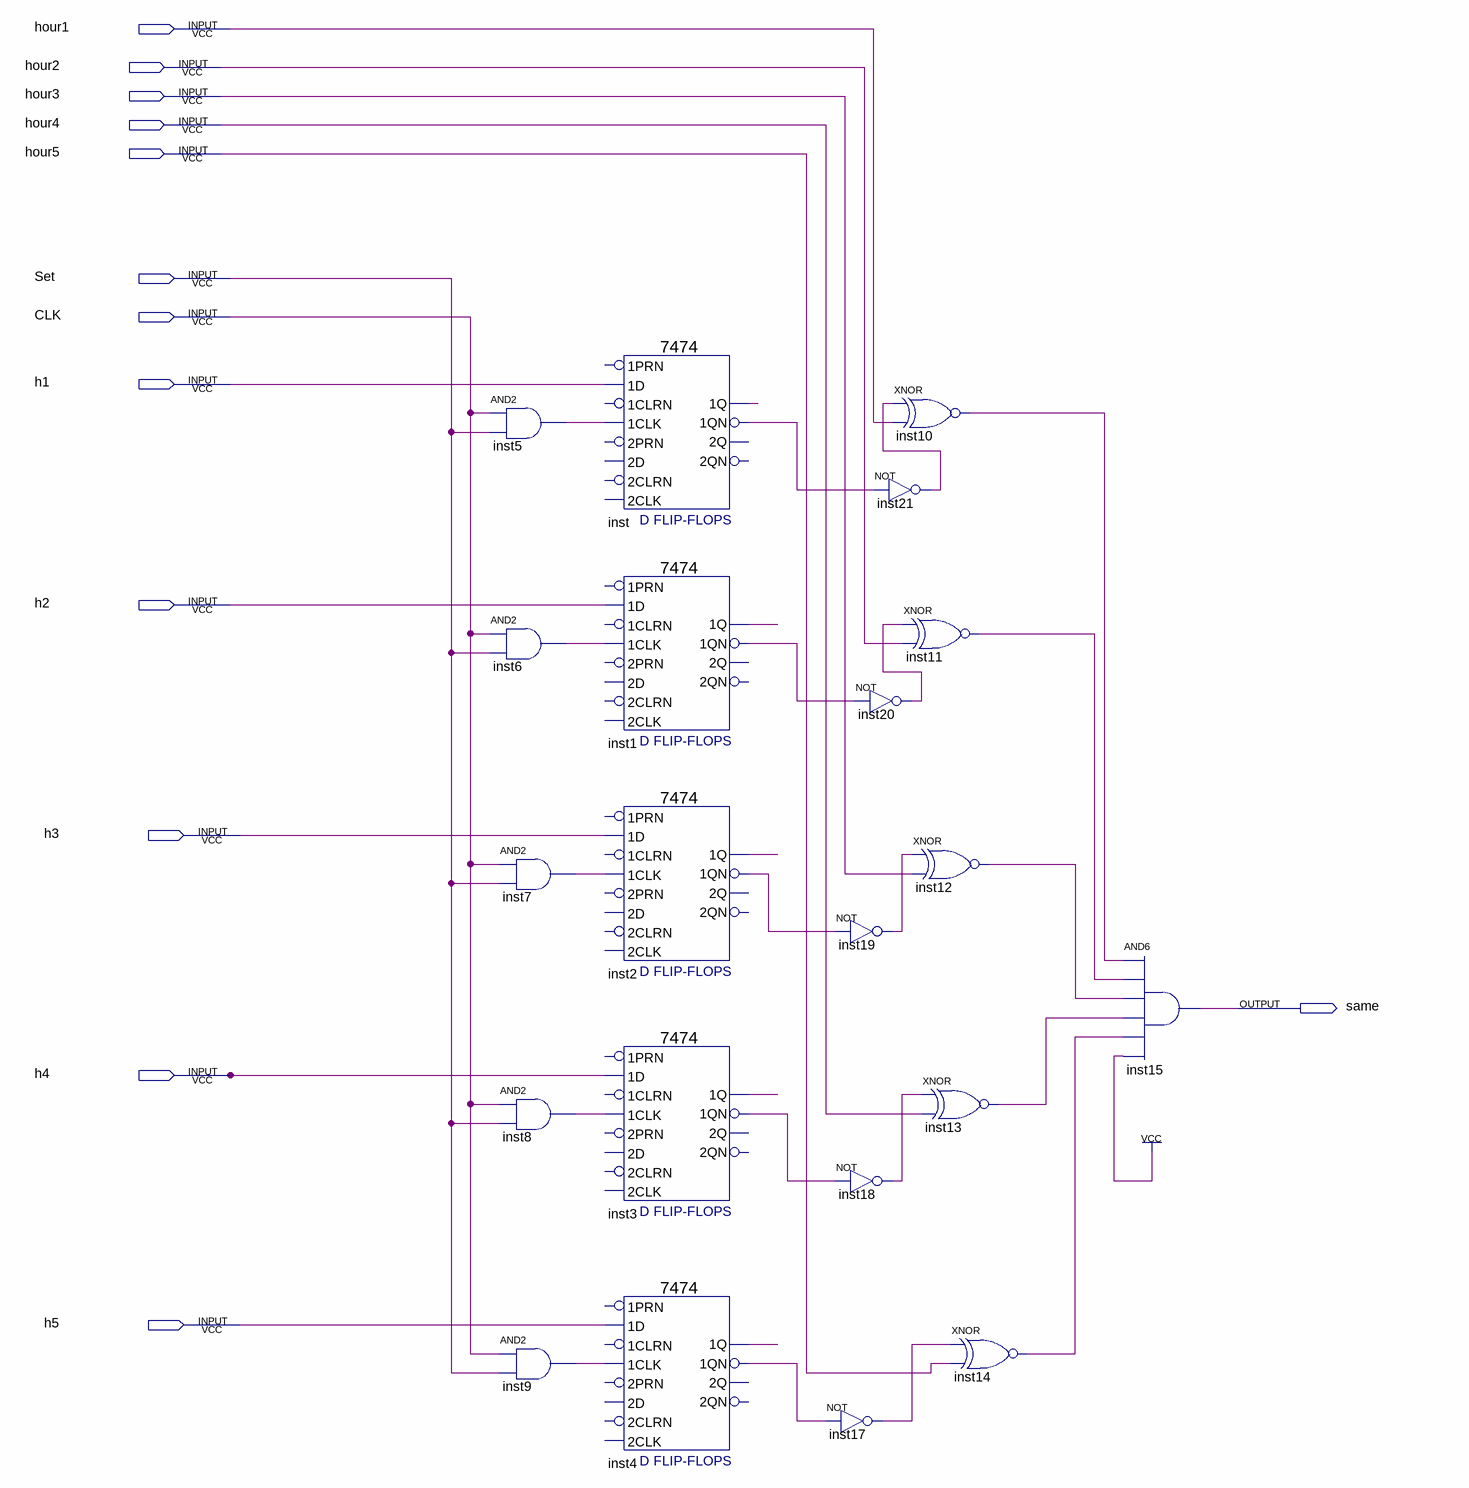
[diagram p0: schematic sheet]
// Quartus schematic same5.bdf as structural Verilog: 21 symbols, 13 pins
module same5 (
  input  hour1,
  input  hour2,
  input  hour3,
  input  hour4,
  input  hour5,
  input  Set,
  input  CLK,
  input  h1,
  input  h2,
  input  h3,
  input  h4,
  input  h5,
  output same
);

  wire inst1_1q, inst1_1qn, inst2_1q, inst2_1qn, inst3_1q, inst3_1qn, inst4_1q, inst4_1qn, inst5_out,
       inst6_out, inst7_out, inst8_out, inst9_out, inst10_out, inst11_out, inst12_out, inst13_out,
       inst14_out, inst17_out, inst18_out, inst19_out, inst20_out, inst21_out, inst_1q, inst_1qn;

  and inst5 (inst5_out, CLK, Set);
  and inst6 (inst6_out, CLK, Set);
  and inst7 (inst7_out, CLK, Set);
  and inst8 (inst8_out, CLK, Set);
  and inst9 (inst9_out, CLK, Set);
  \7474  inst (
    .\1CLK (inst5_out), .\1D (h1), .\1QN (inst_1qn), .\1Q (inst_1q));  // open: 2D, 2PRN, 1PRN, 2CLK, 2CLRN, 1CLRN, 2Q, 2QN
  \7474  inst1 (
    .\1CLK (inst6_out), .\1D (h2), .\1QN (inst1_1qn), .\1Q (inst1_1q));  // open: 2D, 2PRN, 1PRN, 2CLK, 2CLRN, 1CLRN, 2Q, 2QN
  \7474  inst2 (
    .\1CLK (inst7_out), .\1D (h3), .\1QN (inst2_1qn), .\1Q (inst2_1q));  // open: 2D, 2PRN, 1PRN, 2CLK, 2CLRN, 1CLRN, 2Q, 2QN
  \7474  inst3 (
    .\1CLK (inst8_out), .\1D (h4), .\1QN (inst3_1qn), .\1Q (inst3_1q));  // open: 2D, 2PRN, 1PRN, 2CLK, 2CLRN, 1CLRN, 2Q, 2QN
  \7474  inst4 (
    .\1CLK (inst9_out), .\1D (h5), .\1QN (inst4_1qn), .\1Q (inst4_1q));  // open: 2D, 2PRN, 1PRN, 2CLK, 2CLRN, 1CLRN, 2Q, 2QN
  not inst20 (inst20_out, inst1_1qn);
  not inst19 (inst19_out, inst2_1qn);
  not inst18 (inst18_out, inst3_1qn);
  not inst17 (inst17_out, inst4_1qn);
  xnor inst10 (inst10_out, inst21_out, hour1);
  not inst21 (inst21_out, inst_1qn);
  xnor inst11 (inst11_out, inst20_out, hour2);
  xnor inst12 (inst12_out, inst19_out, hour3);
  xnor inst13 (inst13_out, inst18_out, hour4);
  xnor inst14 (inst14_out, inst17_out, hour5);
  and inst15 (same, inst10_out, inst11_out, inst12_out, inst13_out, inst14_out, 1'b1);
endmodule
